# Altium schematic sheet BatteryStepDownHV.SchDoc
size A4
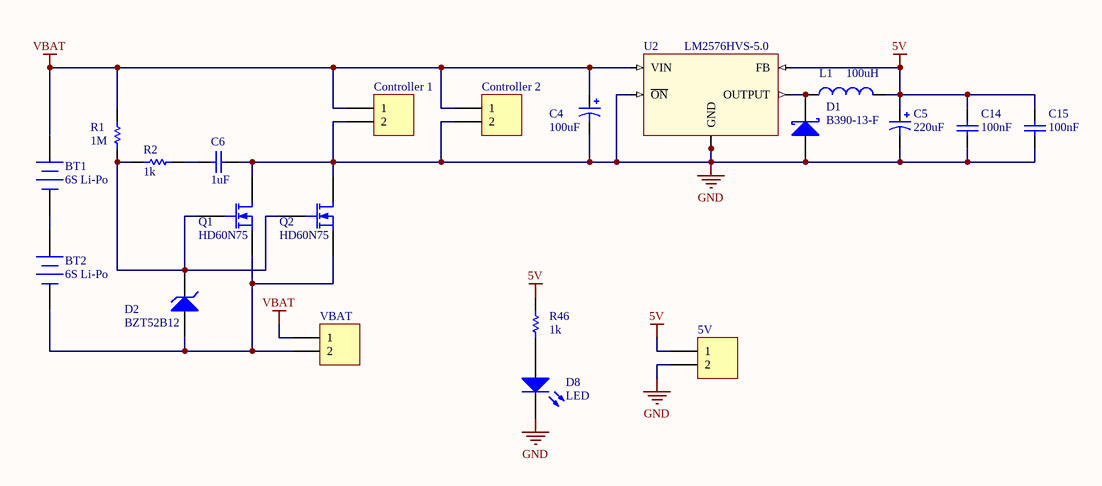
[diagram p0: BatteryStepDownHV.SchDoc]

## Parts
5V  Header 2  [HDR1X2]  (value not drawn)
BT1  6S Li-Po  [Wire Terminals]
BT2  6S Li-Po  [Wire Terminals]
C4  value 100uF  [10x10.5]  (hidden comment: Cap Pol1)
C5  value 220uF  [6.3X5.4]  (hidden comment: Cap Pol1)
C6  value 1uF  [6-0805_M]  (hidden comment: Cap)
C14  value 100nF  [J1-0603]  (hidden comment: Cap)
C15  value 100nF  [J1-0603]  (hidden comment: Cap)
Controller_1  Header 2  [Wire Terminals]  (value not drawn)
Controller_2  Header 2  [Wire Terminals]  (value not drawn)
D1  B390-13-F  [B390]
D2  BZT52B12  [SOD-123]
D8  LED  [J1-0603 LED]
L1  value 100uH  [SLF12575]  (hidden comment: Inductor)
Q1  HD60N75  [TO-252]
Q2  HD60N75  [TO-252]
R1  value 1M  [J1-0603]  (hidden comment: Res1)
R2  value 1k  [J1-0603]  (hidden comment: Res1)
R46  value 1k  [J1-0603]  (hidden comment: Res1)
U2  LM2576HVS-5.0  [KTT0005B]
VBAT  Header 2  [HDR1X2]  (value not drawn)

## Nets
5V: 5V.1 C5.1 C14.2 C15.2 L1.2 R46.2 U2.4(FB)
GND: 5V.2 C4.2 C5.2 C6.1 C14.1 C15.1 Controller_1.2 Controller_2.2 D1.1(A) D8.2(K) Q1.2(D) Q2.2(D) U2.3(GND) U2.5(~{ON}) U2.6(TAB)
VBAT: BT1.1(+) C4.1 Controller_1.1 Controller_2.1 R1.2 U2.1(VIN) VBAT.1
NetBT1_2: BT1.2(-) BT2.1(+)
NetBT2_2: BT2.2(-) D2.1(A) Q1.3(S) Q2.3(S) VBAT.2
NetC6_2: C6.2 R2.2
NetD1_2: D1.2(K) L1.1 U2.2(OUTPUT)
NetD2_2: D2.2(K) Q1.1(G) Q2.1(G) R1.1 R2.1
NetD8_1: D8.1(A) R46.1

## Library data of the parts
5V Controller_1 Controller_2 VBAT = Header 2: Header, 2-Pin; LatestRevisionDate: 17-Jul-2002; LatestRevisionNote: Re-released for DXP Platform.; Publisher: Altium Limited
BT1 BT2 = Battery: Multicell Battery; Published: 24-Mar-1999; LatestRevisionDate: 17-Jul-2002; LatestRevisionNote: Re-released for DXP Platform.; PackageReference: BAT-2; Publisher: Altium Limited; PackageDescription: Battery; 2 Leads
C4 C5 = Cap Pol1: Polarized Capacitor (Radial); Published: 8-Jun-2000; LatestRevisionDate: 17-Jul-2002; LatestRevisionNote: Re-released for DXP Platform.; PackageReference: RB7.6-15; Publisher: Altium Limited; PackageDescription: Polarized Capacitor (Radial); 2 Leads
  C4: LCSC: C59944
  C5: LCSC: C131157
C6 C14 C15 = Cap: Capacitor; Published: 8-Jun-2000; LatestRevisionDate: 17-Jul-2002; LatestRevisionNote: Re-released for DXP Platform.; PackageReference: RAD-0.3; Publisher: Altium Limited; PackageDescription: Radial Cap, Thru-Hole; 2 Leads; 0.3 in Pin Spacing
  C6: LCSC: C105952
  C14 C15: LCSC: C153795
D1 = D Schottky: Schottky Diode; Published: 8-Jun-2000; LatestRevisionDate: 17-Jul-2002; LatestRevisionNote: Re-released for DXP Platform.; PackageReference: SMB; Publisher: Altium Limited; PackageDescription: DO-214-AA/SMB; 2 C-Bend Leads; Body 5.3 x 3.6 mm, inc. leads (LxW); Code_JEDEC: DO-214-AA; LCSC: C134458
D2 = D Zener: Zener Diode; Published: 8-Jun-2000; LatestRevisionDate: 17-Jul-2002; LatestRevisionNote: Re-released for DXP Platform.; PackageReference: DIODE-0.7; Publisher: Altium Limited; PackageDescription: Diode, Thru-Hole; 2 Leads; 0.7 in Pin Spacing; LCSC: C213153
L1 = Inductor: Code_IEC: 1005; Published: 8-Jun-2000; LatestRevisionDate: 29-May-2009; LatestRevisionNote: IPC-7351 Footprint Added.; PackageReference: 0402-A; Publisher: Altium Limited; PackageDescription: Chip Inductor; Code_JEITA: 0402; LCSC: C81470
Q1 Q2 = HD60N75: N-Channel MOSFET 75V/60A; Published: 8-Jun-2000; LatestRevisionDate: 17-Jul-2002; LatestRevisionNote: Re-released for DXP Platform.; PackageVersion: 1995/1996; PackageReference: E3; Publisher: Altium Limited; PackageDescription: TO, Flat Index; 3 In-Line, Axial Leads; Body Dia. 4.6mm; Lead Dia. 0.5 mm (max); LCSC: C216253
R1 R2 R46 = Res1: Resistor; Published: 8-Jun-2000; LatestRevisionDate: 17-Jul-2002; LatestRevisionNote: Re-released for DXP Platform.; PackageReference: AXIAL-0.3; Publisher: Altium Limited; PackageDescription: Axial Device, Thru-Hole; 2 Leads; 0.3 in Pin Spacing
U2 = LM2576/HV: LCSC: C234209
D8 = LED: Published: 8-Jun-2000; LatestRevisionDate: 17-Jul-2002; LatestRevisionNote: Re-released for DXP Platform.; PackageVersion: Feb-2002; PackageReference: 3.2X1.6X1.1; Publisher: Altium Limited; PackageDescription: SM LED; 2 Flat Leads; LCSC: C205450